# Altium schematic sheet Power.SchDoc
size A
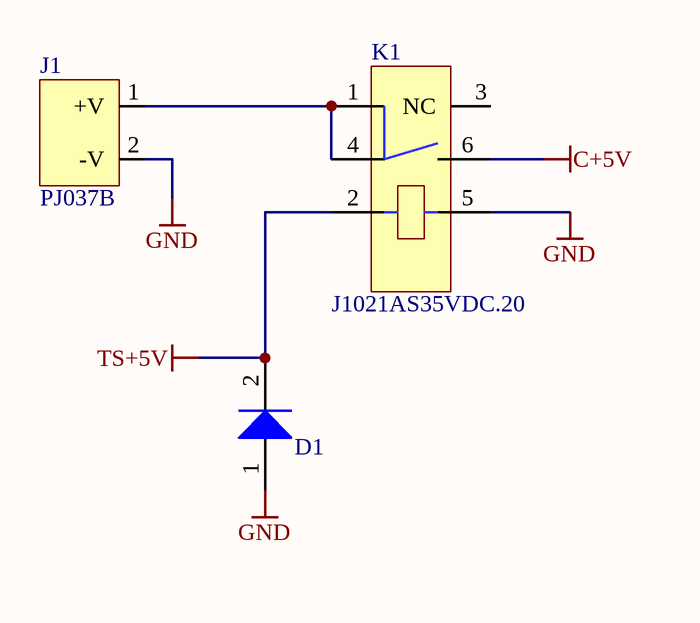
[diagram p0: Power.SchDoc]

## Parts
D1  1N4004  [DO41]  (value not drawn)
J1  PJ037B  [PJ037B]
K1  J1021AS35VDC.20  [HE7X]

## Nets
C+5V: K1.6
GND: D1.1(A) J1.2(-V) K1.5
TS+5V: D1.2(K) K1.2
NetJ1_1: J1.1(+V) K1.1 K1.4

Not connected (* = marked no-connect by the designer): K1 3(NC)

## Library data of the parts
D1 = 1N4004: Diode 400 V 1A Through Hole DO-41; MFG PN: 1N4004-T; DK PN: N4004DICT-ND; MFG: Diodes Inc; FOOTPRINT: DO-41; Populate: *
J1 = PJ037B: Power Barrel Connector Jack 2.50mm ID (0.098"), 5.50mm OD (0.217") Through Hole, Right Angle; MFG PN: PJ-037B; DK PN: CP-037B-ND; MFG: CUI
K1 = J1021AS35VDC.20: RELAY GEN PURPOSE SPST 3A 5V; DK PN: 2449-J1021AS35VDC.20-ND; MFG: CIT; MFG PN: J1021AS35VDC.20; Populate: *